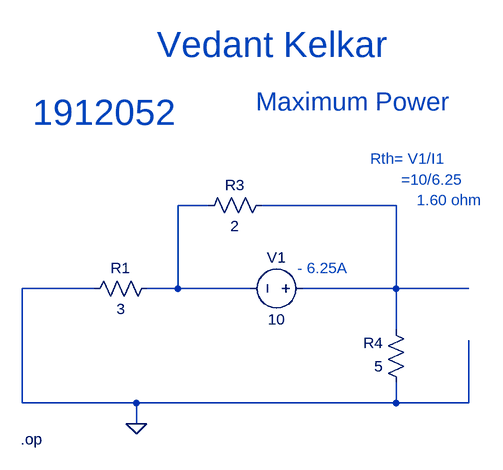
[diagram p0: schematic Draft4.asc]
Draft4.asc, the LTspice schematic file:
Version 4
SHEET 1 880 680
WIRE 32 64 -16 64
WIRE 320 64 112 64
WIRE -144 192 -256 192
WIRE -16 192 -16 64
WIRE -16 192 -64 192
WIRE 96 192 -16 192
WIRE 320 192 320 64
WIRE 320 192 176 192
WIRE 432 192 320 192
WIRE 320 256 320 192
WIRE -256 368 -256 192
WIRE -80 368 -256 368
WIRE 320 368 320 336
WIRE 320 368 -80 368
WIRE 432 368 432 272
WIRE 432 368 320 368
WIRE -80 400 -80 368
FLAG -80 400 0
SYMBOL res -160 208 R270
WINDOW 0 32 56 VTop 2
WINDOW 3 0 56 VBottom 2
SYMATTR InstName R1
SYMATTR Value 3
SYMBOL res 16 80 R270
WINDOW 0 32 56 VTop 2
WINDOW 3 0 56 VBottom 2
SYMATTR InstName R3
SYMATTR Value 2
SYMBOL res 336 352 R180
WINDOW 0 36 76 Left 2
WINDOW 3 36 40 Left 2
SYMATTR InstName R4
SYMATTR Value 5
SYMBOL voltage 192 192 R90
WINDOW 0 -32 56 VBottom 2
WINDOW 3 32 56 VTop 2
WINDOW 123 0 0 Left 0
WINDOW 39 0 0 Left 0
SYMATTR InstName V1
SYMATTR Value 10
TEXT -48 -184 Left 5 ;Vedant Kelkar
TEXT -240 -80 Left 5 ;1912052
TEXT 104 -96 Left 4 ;Maximum Power
TEXT -258 424 Left 2 !.op
TEXT 168 160 Left 2 ;- 6.25A
TEXT 280 -8 Left 2 ;Rth= V1/I1
TEXT 328 24 Left 2 ;=10/6.25
TEXT 352 56 Left 2 ;1.60 ohm

The netlist it stands for:
* Draft4.asc
R1 0 N001 3
R3 N001 N002 2
R4 0 N002 5
V1 N002 N001 10
* Vedant Kelkar
* 1912052
* Maximum Power
.op
* - 6.25A
* Rth= V1/I1
* =10/6.25
* 1.60 ohm
.backanno
.end